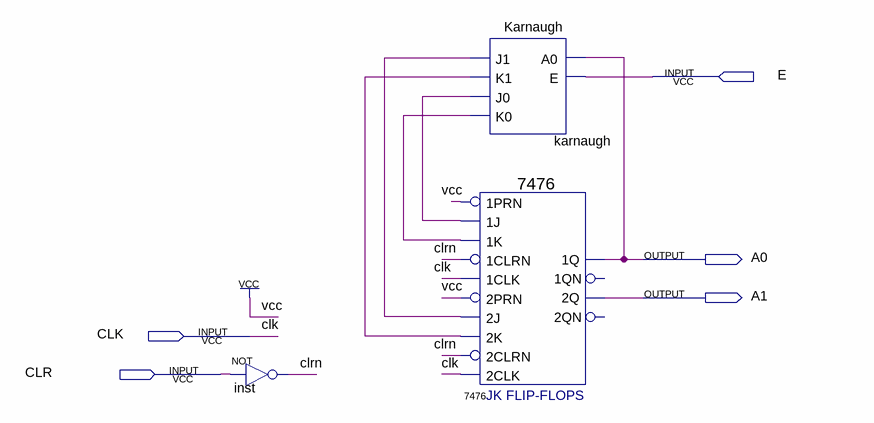
[diagram p0: schematic sheet]
// Quartus schematic Question2.bdf as structural Verilog: 3 symbols, 5 pins
module Question2 (
  input  E,
  input  CLK,
  input  CLR,
  output A0,
  output A1
);

  wire clrn, karnaugh_j0, karnaugh_j1, karnaugh_k0, karnaugh_k1;

  not inst (clrn, CLR);
  Karnaugh karnaugh (.A0(A0), .E(E), .J1(karnaugh_j1), .K1(karnaugh_k1), .J0(karnaugh_j0), .K0(karnaugh_k0));
  \7476  u_7476 (
    .\1J (karnaugh_j0), .\1K (karnaugh_k0), .\1PRN (1'b1), .\2PRN (1'b1), .\2J (karnaugh_j1), .\1CLK (CLK),
    .\1CLRN (clrn), .\2K (karnaugh_k1), .\2CLRN (clrn), .\2CLK (CLK), .\1Q (A0), .\2Q (A1));  // open: 2QN, 1QN
endmodule
